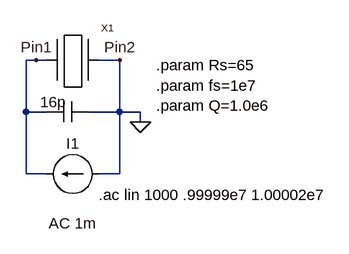
[diagram p0: schematic 07_Crystal_inParallelResonance.asc]
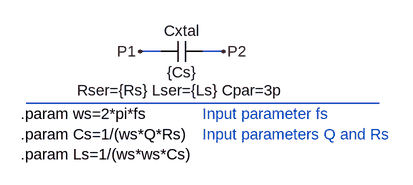
[diagram p1: sub-circuit xtal_param.asc]
07_Crystal_inParallelResonance.asc, the LTspice schematic file:
Version 4
SHEET 1 880 680
WIRE 192 128 176 128
WIRE 208 128 192 128
WIRE 320 128 288 128
WIRE 176 208 176 128
WIRE 208 208 176 208
WIRE 320 208 320 128
WIRE 320 208 272 208
WIRE 352 208 320 208
WIRE 352 224 352 208
WIRE 176 304 176 208
WIRE 208 304 176 304
WIRE 320 304 320 208
WIRE 320 304 288 304
FLAG 352 224 0
FLAG 192 128 Pin1
FLAG 320 128 Pin2
SYMBOL cap 208 224 R270
WINDOW 0 32 32 Invisible 0
WINDOW 3 47 10 VBottom 0
SYMATTR InstName C1
SYMATTR Value 16p
SYMBOL xtal_param 208 160 R0
SYMATTR InstName X1
SYMBOL current 288 304 R90
WINDOW 0 -32 40 VBottom 0
WINDOW 3 32 40 VTop 0
WINDOW 123 60 40 VTop 0
WINDOW 39 0 0 Left 0
SYMATTR InstName I1
SYMATTR Value ""
SYMATTR Value2 AC 1m
TEXT 376 136 Left 0 !.param Rs=65\n.param fs=1e7\n.param Q=1.0e6
TEXT 288 336 Left 0 !.ac lin 1000 .99999e7 1.00002e7

xtal_param.asc, the sub-circuit schematic file:
Version 4
SHEET 1 880 680
WIRE 176 144 144 144
WIRE 272 144 240 144
FLAG 144 144 P1
FLAG 272 144 P2
SYMBOL cap 240 128 R90
WINDOW 0 0 32 VBottom 0
WINDOW 3 32 32 VTop 0
WINDOW 39 60 32 VTop 0
SYMATTR InstName Cxtal
SYMATTR Value {Cs}
SYMATTR SpiceLine Rser={Rs} Lser={Ls} Cpar=3p
TEXT -40 240 Left 0 !.param ws=2*pi*fs\n.param Cs=1/(ws*Q*Rs)\n.param Ls=1/(ws*ws*Cs)
TEXT 240 240 Left 0 ;Input parameter fs\nInput parameters Q and Rs
LINE Normal 512 224 -32 224

The netlist it stands for:
* 07_Crystal_inParallelResonance.asc
C1 Pin1 0 16p
XX1 Pin1 0 xtal_param
I1 0 Pin1 AC 1m

* block symbol definitions
.subckt xtal_param P1 P2
Cxtal P2 P1 {Cs} Rser={Rs} Lser={Ls} Cpar=3p
.param ws=2*pi*fs
.param Cs=1/(ws*Q*Rs)
.param Ls=1/(ws*ws*Cs)
* Input parameter fs
* Input parameters Q and Rs
.ends xtal_param

.param Rs=65
.param fs=1e7
.param Q=1.0e6
.ac lin 1000 .99999e7 1.00002e7
.backanno
.end